# EAGLE schematic core (EAGLE 7.1.0)
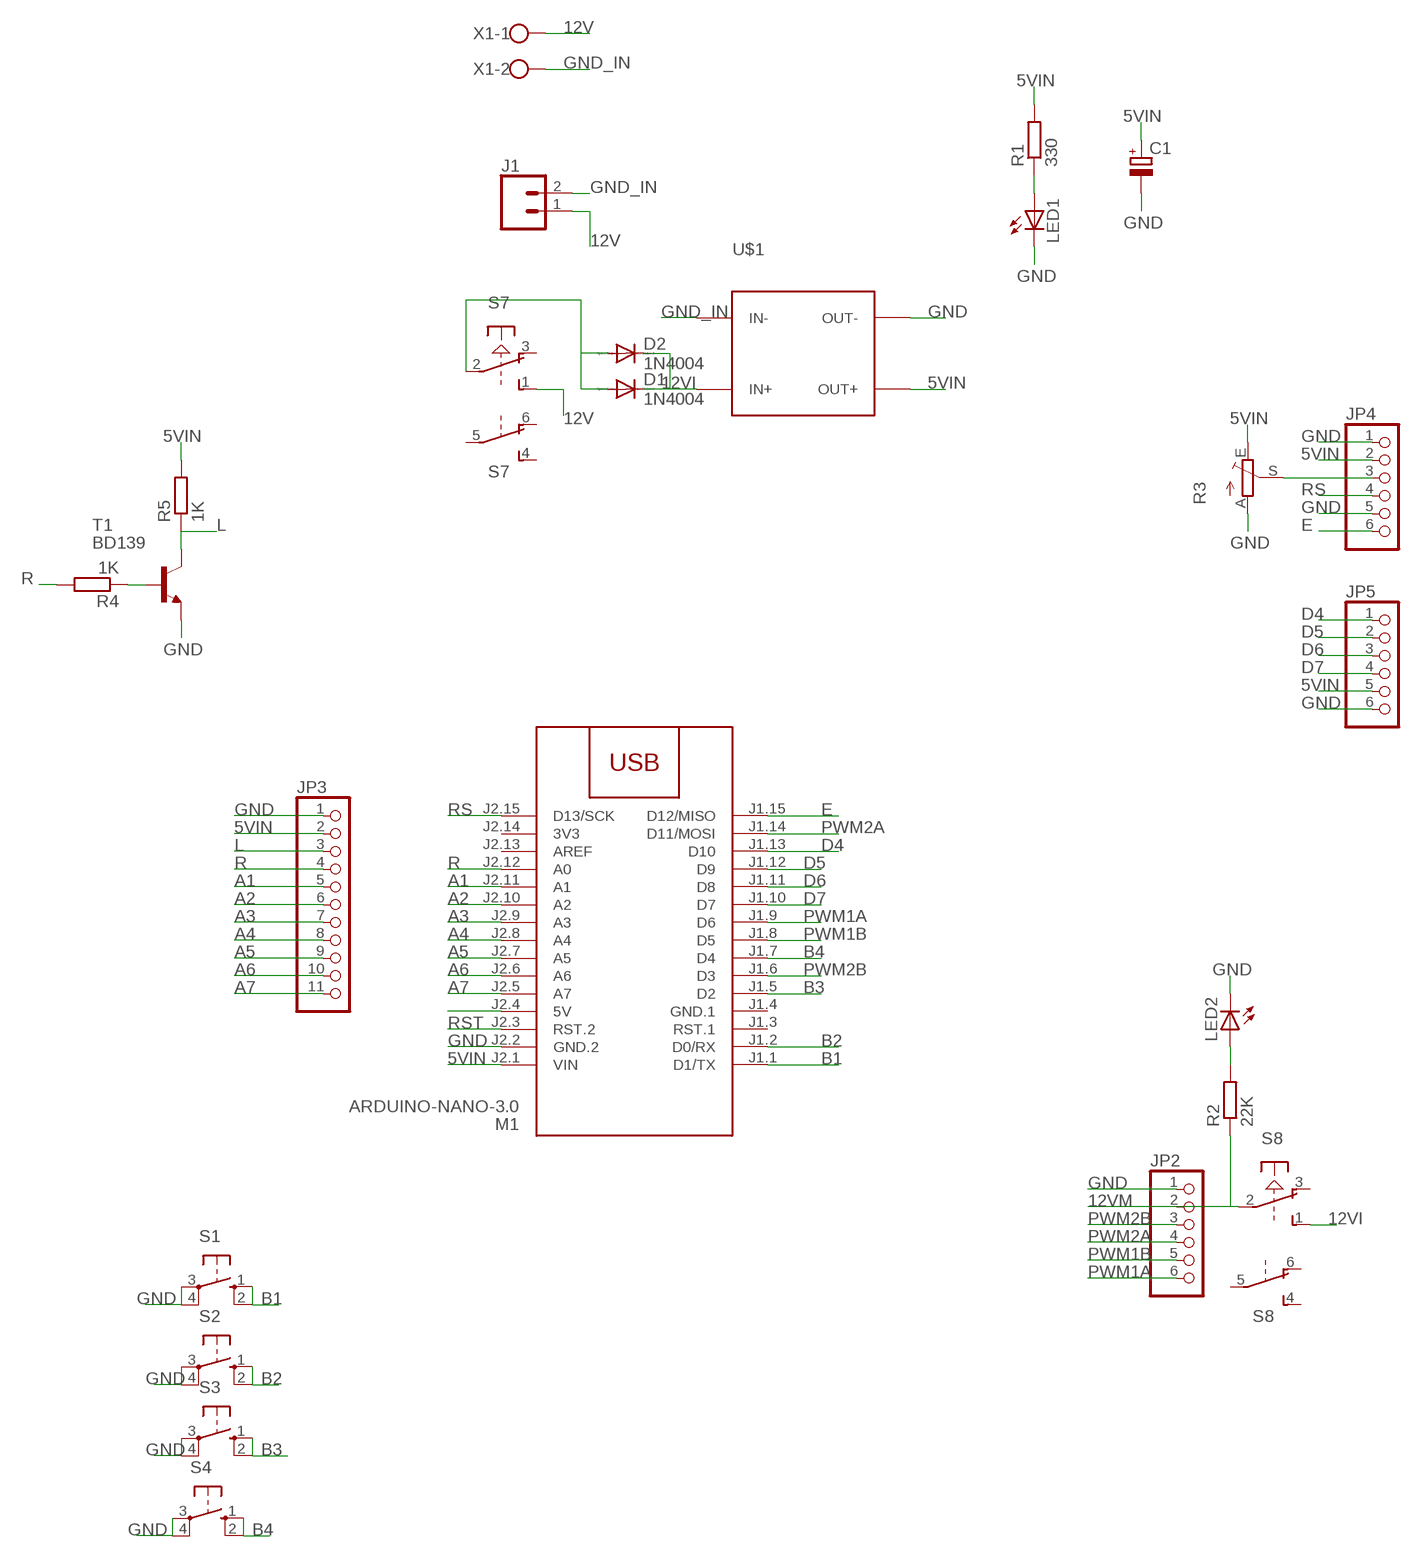
[diagram p0: schematic, sheet 1]

## Parts
C1  CPOL-EUE2.5-6  [E2,5-6]
D1  1N4004  [DO41-10]
D2  1N4004  [DO41-10]
J1  CONN_02POLAR  [MOLEX-1X2]
JP2  PINHD-1X6  [1X06]
JP3  PINHD-1X11  [1X11]
JP4  PINHD-1X6  [1X06]
JP5  PINHD-1X6  [1X06]
LED1  LED3MM  [LED3MM]
LED2  LED3MM  [LED3MM]
M1  ARDUINO-NANO-3.0  [ARDUINO-NANO-3.0]
R1  330  R-EU_0207/7  [0207/7]
R2  22K  R-EU_0207/7  [0207/7]
R3  TRIM_EU-CA6V  [CA6V]
R4  1K  R-EU_0207/7  [0207/7]
R5  1K  R-EU_0207/7  [0207/7]
S1  10-XX  [B3F-10XX]
S2  10-XX  [B3F-10XX]
S3  10-XX  [B3F-10XX]
S4  10-XX  [B3F-10XX]
S7  PVA2R  [PVA2R]
S8  PVA2R  [PVA2R]
T1  BD139  [TO126]
U$1  DC-DC-STEP-DOWN-MP2307  [DC-DC-STEP-DOWN-MP2307]
X1  W237-102  [W237-102]

## Nets
5VIN: C1.+ JP3.2 JP4.2 JP5.5 M1.J2.1(VIN) R1.2 R3.E R5.2 U$1.OUT+
12V: J1.1 S7.1(1:S) X1.1
12VI: D1.C D2.C S8.1(1:S) U$1.IN+
12VM: JP2.2 R2.1 S8.2(1:P)
A1: JP3.5 M1.J2.11(A1)
A2: JP3.6 M1.J2.10(A2)
A3: JP3.7 M1.J2.9(A3)
A4: JP3.8 M1.J2.8(A4)
A5: JP3.9 M1.J2.7(A5)
A6: JP3.10 M1.J2.6(A6)
A7: JP3.11 M1.J2.5(A7)
B1: M1.J1.1(D1/TX) S1.1(S) S1.2(S1)
B2: M1.J1.2(D0/RX) S2.1(S) S2.2(S1)
B3: M1.J1.5(D2) S3.1(S) S3.2(S1)
B4: M1.J1.7(D4) S4.1(S) S4.2(S1)
D4: JP5.1 M1.J1.13(D10)
D5: JP5.2 M1.J1.12(D9)
D6: JP5.3 M1.J1.11(D8)
D7: JP5.4 M1.J1.10(D7)
E: JP4.6 M1.J1.15(D12/MISO)
GND: C1.- JP2.1 JP3.1 JP4.1 JP4.5 JP5.6 LED1.K(C) LED2.K(C) M1.J2.2(GND.2) R3.A S1.3(P) S1.4(P1) S2.3(P) S2.4(P1) S3.3(P) S3.4(P1) S4.3(P) S4.4(P1) T1.1(E) U$1.OUT-
GND_IN: J1.2 U$1.IN- X1.2
L: JP3.3 R5.1 T1.2(C)
N$1: D1.A D2.A S7.2(1:P)
N$2: LED1.A R1.1
N$6: LED2.A R2.2
N$7: R4.1 T1.3(B)
N$8: JP4.3 R3.S
N$9: M1.J2.4(5V)
PWM1A: JP2.6 M1.J1.9(D6)
PWM1B: JP2.5 M1.J1.8(D5)
PWM2A: JP2.4 M1.J1.14(D11/MOSI)
PWM2B: JP2.3 M1.J1.6(D3)
R: JP3.4 M1.J2.12(A0) R4.2
RS: JP4.4 M1.J2.15(D13/SCK)
RST: M1.J2.3(RST.2)
Unconnected: M1.J1.3(RST.1) M1.J2.13(AREF) S7.3(1:O) S7.4(2:S) S7.5(2:P) S7.6(2:O) S8.3(1:O) S8.4(2:S) S8.5(2:P) S8.6(2:O)

## Power pins joined to a net without a drawn wire
3V3: M1.J2.14(3V3)
GND.1: M1.J1.4(GND.1)

## Library data of the parts
C1 = rcl:CPOL-EU: POLARIZED CAPACITOR, European symbol
D1 D2 = diode:1N4004: DIODE general purpose rectifier, 1 A
J1 = SparkFun-Retired:CONN_02: Multi connection point. Often used as Generic Header-pin footprint for 0.1 inch spaced/style header connections On any of the 0.1 inch spaced packages, you can populate with these: Break Away Headers - Straight <https://www.sparkfun.com/products/116> (PRT-00116) Break Away Male Headers - Right Angle <https://www.sparkfun.com/products/553> (PRT-00553) Female Headers <https://www.sparkfun.com/products/115> (PRT-00115) Break Away Headers - Machine Pin <https://www.sparkfun.com/products/117> (PRT-00117) Break Away Female Headers - Swiss Machine Pin <https://www.sparkfun.com/products/743> (PRT-00743) For SCREWTERMINALS and SPRING TERMINALS visit here: Screw Terimnals on SparkFun.com <https://www.sparkfun.com/search/results?term=Screw+Terminals> (5mm/3.5mm/2.54mm spacing) This device is also useful as a general connection point to wire up your design to another part of your project. Our various solder wires solder well into these plated through hole pads. Hook-Up Wire - Assortment (Stranded, 22 AWG) <https://www.sparkfun.com/products/11375> (PRT-11375) Hook-Up Wire - Assortment (Solid Core, 22 AWG) <https://www.sparkfun.com/products/11367> (PRT-11367) View the entire wire category on our website here <https://www.sparkfun.com/categories/141> Special notes: Molex polarized connector foot print use with: PRT-08233 with associated crimp pins and housings. 2.54_SCREWTERM for use with PRT-10571. 3.5mm Screw Terminal footprints for PRT-08084 5mm Screw Terminal footprints for use with PRT-08432; SF_ID: PRT-09918
JP2 JP4 JP5 = pinhead:PINHD-1X6: PIN HEADER
JP3 = pinhead:PINHD-1X11: PIN HEADER
LED1 LED2 = led:LED: LED OSRAM: - CHIPLED LG R971, LG N971, LY N971, LG Q971, LY Q971, LO R971, LY R971 LH N974, LH R974 LS Q976, LO Q976, LY Q976 LO Q996 - Hyper CHIPLED LW Q18S LB Q993, LB Q99A, LB R99A - SideLED LS A670, LO A670, LY A670, LG A670, LP A670 LB A673, LV A673, LT A673, LW A673 LH A674 LY A675 LS A676, LA A676, LO A676, LY A676, LW A676 LS A679, LY A679, LG A679 - Hyper Micro SIDELED® LS Y876, LA Y876, LO Y876, LY Y876 LT Y87S - SmartLED LW L88C, LW L88S LB L89C, LB L89S, LG L890 LS L89K, LO L89K, LY L89K LS L896, LA L896, LO L896, LY L896 - TOPLED LS T670, LO T670, LY T670, LG T670, LP T670 LSG T670, LSP T670, LSY T670, LOP T670, LYG T670 LG T671, LOG T671, LSG T671 LB T673, LV T673, LT T673, LW T673 LH T674 LS T676, LA T676, LO T676, LY T676, LB T676, LH T676, LSB T676, LW T676 LB T67C, LV T67C, LT T67C, LS T67K, LO T67K, LY T67K, LW E67C LS E67B, LA E67B, LO E67B, LY E67B, LB E67C, LV E67C, LT E67C LW T67C LS T679, LY T679, LG T679 LS T770, LO T770, LY T770, LG T770, LP T770 LB T773, LV T773, LT T773, LW T773 LH T774 LS E675, LA E675, LY E675, LS T675 LS T776, LA T776, LO T776, LY T776, LB T776 LHGB T686 LT T68C, LB T68C - Hyper Mini TOPLED® LB M676 - Mini TOPLED Santana® LG M470 LS M47K, LO M47K, LY M47K Source: http://www.osram.convergy.de LUXEON: - LUMILED® LXK2-PW12-R00, LXK2-PW12-S00, LXK2-PW14-U00, LXK2-PW14-V00 LXK2-PM12-R00, LXK2-PM12-S00, LXK2-PM14-U00 LXK2-PE12-Q00, LXK2-PE12-R00, LXK2-PE12-S00, LXK2-PE14-T00, LXK2-PE14-U00 LXK2-PB12-K00, LXK2-PB12-L00, LXK2-PB12-M00, LXK2-PB14-N00, LXK2-PB14-P00, LXK2-PB14-Q00 LXK2-PR12-L00, LXK2-PR12-M00, LXK2-PR14-Q00, LXK2-PR14-R00 LXK2-PD12-Q00, LXK2-PD12-R00, LXK2-PD12-S00 LXK2-PH12-R00, LXK2-PH12-S00 LXK2-PL12-P00, LXK2-PL12-Q00, LXK2-PL12-R00 Source: www.luxeon.com KINGBRIGHT: KA-3528ASYC Source: www.kingbright.com
M1 = diy-modules:ARDUINO-NANO-3.0: Arduino Nano 3.0 and compatible devices More details available here: https://www.arduino.cc/en/Main/ArduinoBoardNano Click here to find device on ebay.com <http://www.ebay.com/sch/arduino+nano>
R1 R2 R4 R5 = rcl:R-EU_: RESISTOR, European symbol
R3 = pot:TRIM_EU-: POTENTIOMETER
S1-S4 = switch-omron:10-XX: OMRON SWITCH; MPN: B3F-1000; OC_FARNELL: 176432; OC_NEWARK: 36M3542
S7 S8 = switch-misc:PVA2R: ITT SWITCH
T1 = transistor-neu-to92:BD139: NPN TRANSISTOR
U$1 = diy-modules:DC-DC-STEP-DOWN-MP2307: DC/DC Step-Down Regulator based on MP2307DN chip MP2307 datasheet available here: https://cdn-shop.adafruit.com/datasheets/MP2307_r1.9.pdf Click here to find device on ebay.com <http://www.ebay.com/sch/dc+dc+3a+mini+converter>
X1 = con-wago-500:W237-102: WAGO SCREW CLAMP; MPN: 237-102; OC_FARNELL: unknown; OC_NEWARK: 70K9898